# Altium schematic sheet Ampli_audio.SchDoc
size A4
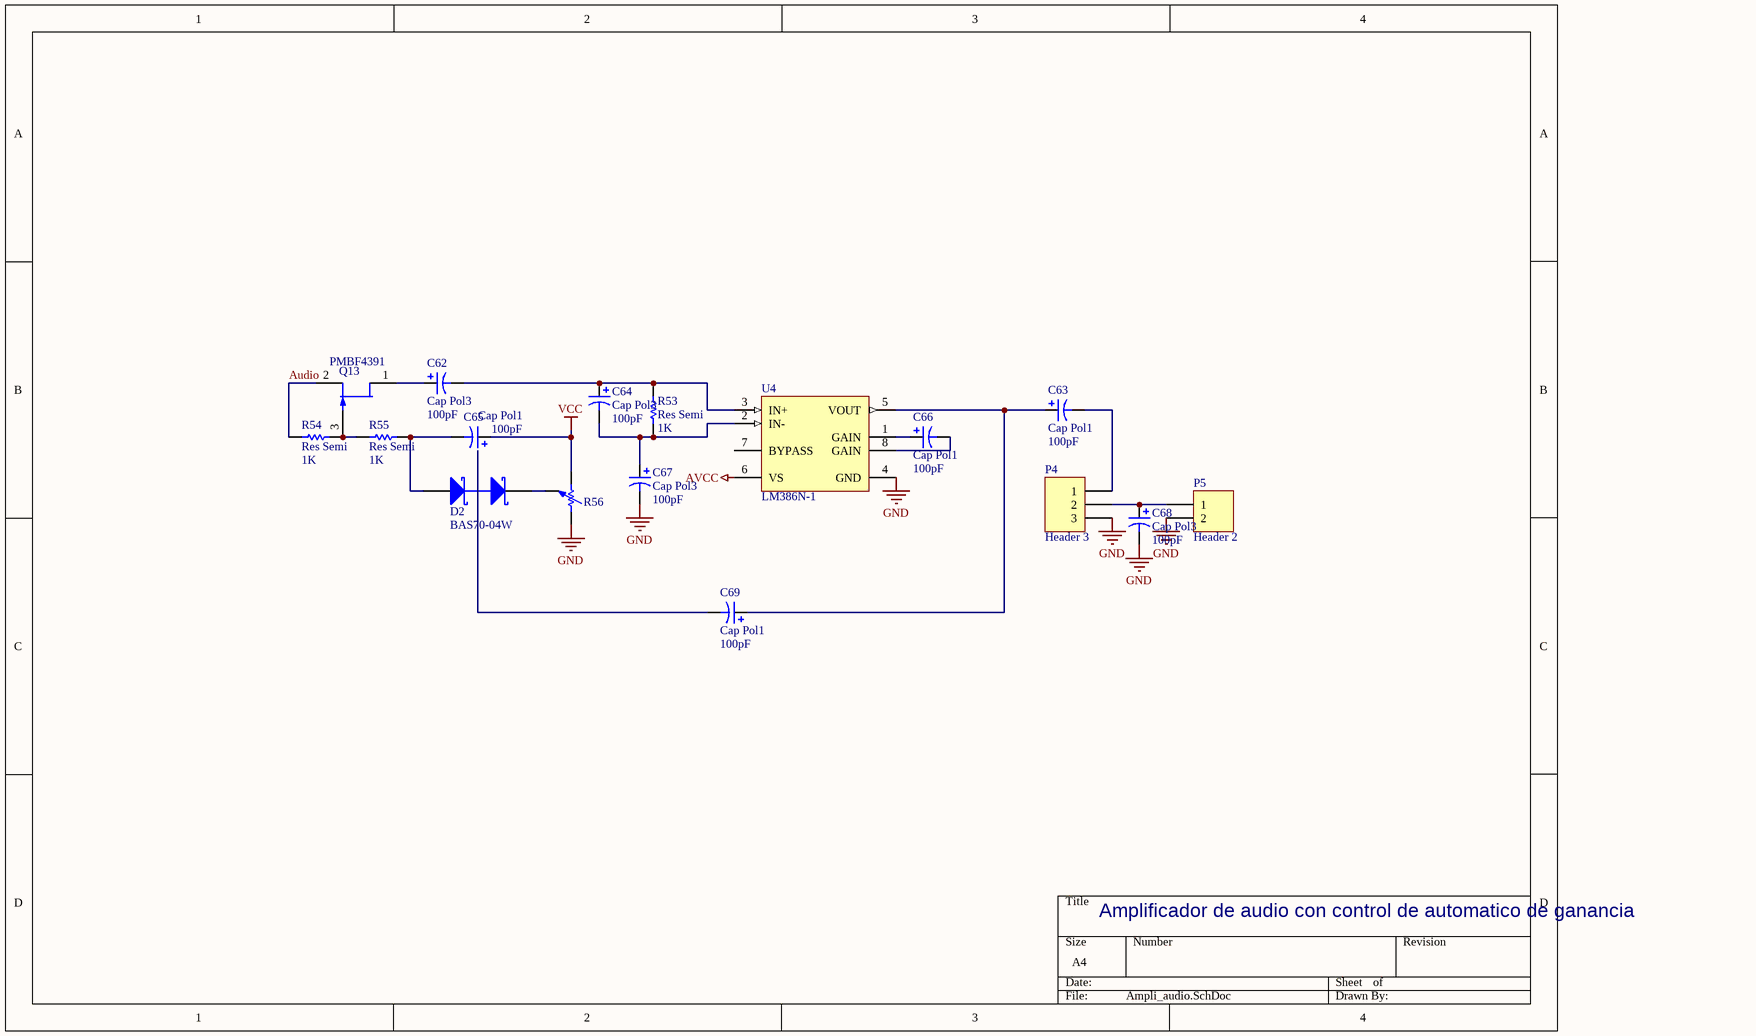
[diagram p0: Ampli_audio.SchDoc]

## Parts
C62  Cap Pol3  value 100pF  [C0805]
C63  Cap Pol1  value 100pF  [B]
C64  Cap Pol3  value 100pF  [C0805]
C65  Cap Pol1  value 100pF  [B]
C66  Cap Pol1  value 100pF  [B]
C67  Cap Pol3  value 100pF  [C0805]
C68  Cap Pol3  value 100pF  [C0805]
C69  Cap Pol1  value 100pF  [B]
D2  BAS70-04W  [SOT323_N]
P4  Header 3  [HDR1X3]
P5  Header 2  [HDR1X2]
Q13  PMBF4391  [SOT-23]
R53  Res Semi  value 1K  [2012[0805]]
R54  Res Semi  value 1K  [2012[0805]]
R55  Res Semi  value 1K  [2012[0805]]
R56  Pot  [Potenciometro]  (value not drawn)
U4  LM386N-1  [DIP8]

## Nets
AVCC: U4.6(VS)
GND: C67.2 C68.2 P4.3 P5.2 R56.1 U4.4(GND)
VCC: C65.1 R56.2
Audio: Q13.2(S) R54.1
NetC62_1: C62.1 Q13.1(D)
NetC62_2: C62.2 C64.1 R53.2 U4.3(IN+)
NetC63_1: C63.1 C69.1 U4.5(VOUT)
NetC63_2: C63.2 P4.1
NetC64_2: C64.2 C67.1 R53.1 U4.2(IN-)
NetC65_2: C65.2 D2.1(A) R55.2
NetC66_1: C66.1 U4.1(GAIN)
NetC66_2: C66.2 U4.8(GAIN)
NetC68_1: C68.1 P4.2 P5.1
NetC69_2: C69.2 D2.3(C)
NetD2_2: D2.2(K) R56.3
NetQ13_3: Q13.3(G) R54.2 R55.1

Not connected (* = marked no-connect by the designer): U4 7(BYPASS)

## Notes on the sheet
- Amplificador de audio con control de automatico de ganancia

## Library data of the parts
C62 C64 C67 C68 = Cap Pol3: Polarized Capacitor (Surface Mount); Published: 8-Jun-2000; LatestRevisionDate: 17-Jul-2002; LatestRevisionNote: Re-released for DXP Platform.; PackageReference: C0805; Publisher: Altium Limited
C63 C65 C66 C69 = Cap Pol1: Polarized Capacitor (Radial); Published: 8-Jun-2000; LatestRevisionDate: 17-Jul-2002; LatestRevisionNote: Re-released for DXP Platform.; PackageReference: RB7.6-15; Publisher: Altium Limited
D2 = BAS70-04W: Schottky Barrier Double Diode; Published: 17-Sep-2003; LatestRevisionDate: 12-Dec-2006; LatestRevisionNote: IPC-7351 Footprint Added.; DatasheetVersion: 26-Mar-1999; PackageVersion: Apr-1999; PackageReference: SOT323; Publisher: Altium Limited; PackageDescription: 3-Pin SOT-323 Package 0.65 mm Pitch, 2.1 mm Lead Span; ComponentLink1Description: Manufacturer Link; ComponentLink1URL: http://www.semiconductors.philips.com/; ComponentLink2Description: Datasheet; ComponentLink2URL: http://www.semiconductors.philips.com/acrobat/datasheets/BAS70W_3.pdf
P4 = Header 3: Header, 3-Pin; LatestRevisionDate: 17-Jul-2002; LatestRevisionNote: Re-released for DXP Platform.; Publisher: Altium Limited
P5 = Header 2: Header, 2-Pin; LatestRevisionDate: 17-Jul-2002; LatestRevisionNote: Re-released for DXP Platform.; Publisher: Altium Limited
Q13 = PMBF4391: N-channel Silicon Junction Field-effect Transistor; Published: 17-Sep-2003; LatestRevisionDate: 12-Dec-2006; LatestRevisionNote: IPC-7351 Footprint Added.; DatasheetVersion: Apr-1995; PackageVersion: May-1999; PackageReference: SOT23; Publisher: Altium Limited; PackageDescription: 3-Pin SOT-23 Package 0.95 mm Pitch, 2.3 mm Lead Span; ComponentLink1Description: Manufacturer Link; ComponentLink1URL: http://www.semiconductors.philips.com/; ComponentLink2Description: Datasheet; ComponentLink2URL: http://www.semiconductors.philips.com/acrobat/datasheets/PMBF4391_4392_4393_CNV_2.pdf
R53-R55 = Res Semi: Semiconductor Resistor; Published: 8-Jun-2000; LatestRevisionDate: 17-Jul-2002; LatestRevisionNote: Re-released for DXP Platform.; PackageReference: AXIAL-0.5; Publisher: Altium Limited
U4 = LM386N-1: Low Voltage Audio Power Amplifier; Manufacturer: National Semiconductor; CompType: Audio IC; PackageTopMarking: NSUZXYTT*LM*386N-1; Published: 27-Nov-2008; DatasheetVersion: Aug-2000; PackageVersion: revG, May-2006; PackageReference: N08E; PackageDescription: MDIP, .365 x .250 x .130in, 8 Lead, .100in Pitch; PartNumber: LM386N-1; RoHS: O; PinCount: 8; DigiKeyPartNumber: LM386N-1-ND; Code_JEDEC: MS-001-BA; ComponentLink1Description: LM386 Datasheet; ComponentLink1URL: http://www.national.com/ds/LM/LM386.pdf; ComponentLink2Description: LM386 Web Page; ComponentLink2URL: http://www.national.com/pf/LM/LM386.html; ComponentLink3Description: N08E Package Page; ComponentLink3URL: http://www.national.com/packaging/folders/n08e.html